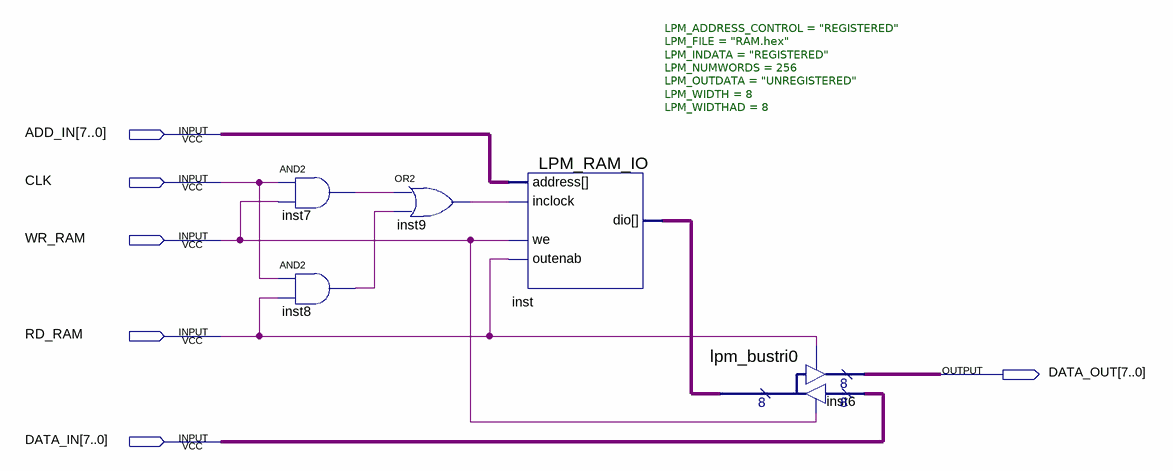
[diagram p0: schematic sheet]
// Quartus schematic RAM.bdf as structural Verilog: 5 symbols, 6 pins
module RAM (
  input  [7:0] ADD_IN,
  input  CLK,
  input  WR_RAM,
  input  RD_RAM,
  input  [7:0] DATA_IN,
  output [7:0] DATA_OUT
);

  wire inst7_out, inst8_out, inst9_out;
  wire [7:0] inst_dio;

  and inst7 (inst7_out, CLK, WR_RAM);
  and inst8 (inst8_out, CLK, RD_RAM);
  or inst9 (inst9_out, inst7_out, inst8_out);
  LPM_RAM_IO #(.LPM_ADDRESS_CONTROL("REGISTERED"), .LPM_FILE("RAM.hex"), .LPM_INDATA("REGISTERED"), .LPM_NUMWORDS(256), .LPM_OUTDATA("UNREGISTERED"), .LPM_WIDTH(8), .LPM_WIDTHAD(8)) inst (
    .address(ADD_IN), .inclock(inst9_out), .we(WR_RAM), .outenab(RD_RAM), .dio(inst_dio));
  lpm_bustri0 inst6 (.enabledt(WR_RAM), .data(DATA_IN), .enabletr(RD_RAM), .result(DATA_OUT), .tridata(inst_dio));
endmodule
